# Altium schematic sheet debug.SchDoc: Debug ports and connectors
size A4; Author: Michał Gumiela
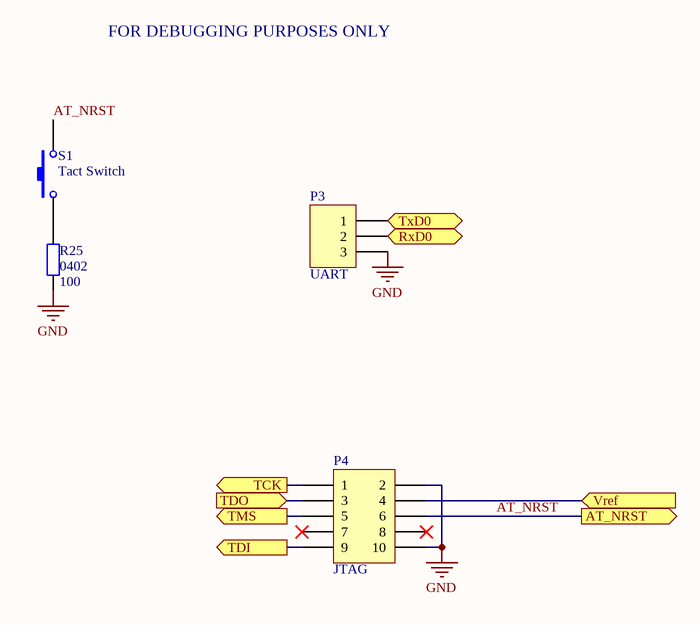
[diagram p0: debug.SchDoc]

## Parts
P3  UART  [HDR1X3]
P4  JTAG  [HDR2X5]
R25  0402  value 100  [SMD_Capacitor_0402]
S1  Tact Switch  [Tact Switch 3x6]

## Ports
AT_NRST (out), RxD0 (out), TCK (out), TDI (out), TDO (in), TMS (out), TxD0 (in), Vref (in)

## Nets
GND: P3.3 P4.2 P4.10 R25.2
AT_NRST: P4.6 S1.2 ; port AT_NRST
RxD0: P3.2 ; port RxD0
TCK: P4.1 ; port TCK
TDI: P4.9 ; port TDI
TDO: P4.3 ; port TDO
TMS: P4.5 ; port TMS
TxD0: P3.1 ; port TxD0
Vref: P4.4 ; port Vref
NetR25_1: R25.1 S1.1

Not connected (* = marked no-connect by the designer): P4 7* 8*

## Notes on the sheet
- FOR DEBUGGING PURPOSES ONLY
- Title:
- Sheet:
- of
- Author:
- Model:
- Document Number:
- Checked by:
- Iss-Rev:
- Approved by:
- Date:
- File name:

## Library data of the parts
P3 = Header 3: Header, 3-Pin; LatestRevisionDate: 17-Jul-2002; LatestRevisionNote: Re-released for DXP Platform.; Publisher: Altium Limited
P4 = Header 5X2: Header, 5-Pin, Dual row; LatestRevisionDate: 17-Jul-2002; LatestRevisionNote: Re-released for DXP Platform.; Publisher: Altium Limited
R25 = Res2: Resistor; Published: 8-Jun-2000; LatestRevisionDate: 17-Jul-2002; LatestRevisionNote: Re-released for DXP Platform.; PackageReference: AXIAL-0.4; Publisher: Altium Limited; PackageDescription: Axial Device, Thru-Hole; 2 Leads; 0.4 in Pin Spacing
S1 = TactSwitch: Supplier 1: Farnell